# Altium schematic sheet Source.SchDoc
size A4; DocumentNumber: 2; SheetNumber: 2; SheetTotal: 5
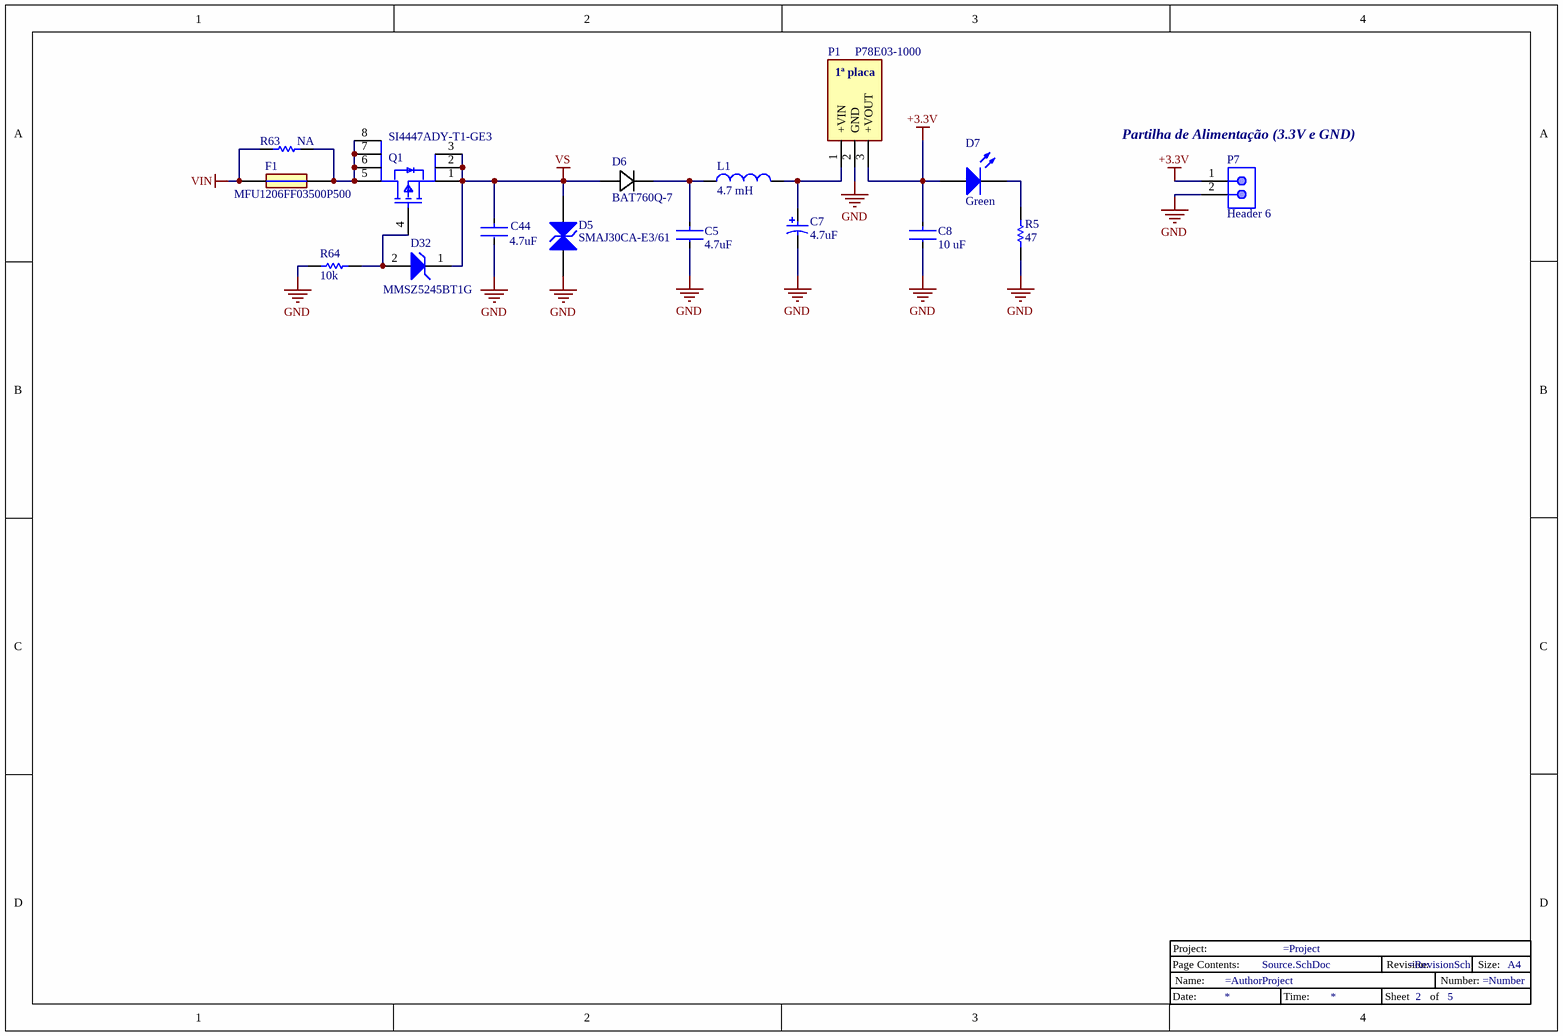
[diagram p0: Source.SchDoc]

## Parts
C5  4.7uF  [FP-GRT21B-0_15-IPC_B]
C7  4.7uF  [KEMT-T491-D_L]
C8  10 uF  [FP-GRM21B-0_2-e0_2_0_7-IPC_C]
C44  4.7uF  [FP-GRT21B-0_15-IPC_B]
D5  SMAJ30CA-E3/61  [VISH-DO-214AC-2_L]
D6  BAT760Q-7  [DIODE_SOD-323_1P7X1P3_DIO-L]
D7  Green  [0805_A]
D32  MMSZ5245BT1G  [ONSC-SOD-123-2-425-04_V]
F1  MFU1206FF03500P500  [RESC3216X65N]
L1  4.7 mH  [WE-TI-LM]
P1  P78E03-1000  [P78E031000]
P7  Header 6  [MOLX-22-27-2021_V]
Q1  SI4447ADY-T1-GE3  [FP-C-06527-MFG]
R5  47  [RESC1608X55X30NL20T20]
R63  NA  [RESC1608X55X25ML10T15]
R64  10k  [RESC1608X55X25ML10T15]
Title_Block_2  Title_Block  (value not drawn)

## Nets
+3.3V: C8.1 D7.2(A) P1.3(+VOUT) P7.1
GND: C5.2 C7.2 C8.2 C44.2 D5.2(A2) P1.2(GND) P7.2 R5.1 R64.1
VIN: F1.1 R63.1
VS: C44.1 D5.1(A1) D6.2 D32.1(K) Q1.1(S) Q1.2(S) Q1.3(S)
NetC5_1: C5.1 D6.1 L1.1
NetC7_1: C7.1 L1.2 P1.1(+VIN)
NetD7_1: D7.1(K) R5.2
NetD32_2: D32.2(A) Q1.4(G) R64.2
NetF1_2: F1.2 Q1.5(D) Q1.6(D) Q1.7(D) Q1.8(D) R63.2

## Notes on the sheet
- 1ª placa
- (near P7) Partilha de Alimentação (3.3V e GND)
- (in symbol Title_Block) Project:; Page Contents:; Revision:; Size:; A4; Name:; Number:; Date:; Time:; Sheet; of

## Library data of the parts
C5 C44 = CMP-06035-019733-1: Cap Ceramic 4.7uF 50V X5R ±10% SMD 0805 +85°C Emboss T/R; Voltage Rating: 50V; Mount: Surface Mount; Ratings: AEC-Q200; Packaging: Tape and Reel; Width: 0.049inch; Case/Package: 0805; Max Operating Temperature: 85°C; Length: 0.079inch; Case Code (Imperial): 0805; Capacitance: 4.7uF; Thickness: 0.057inch; Min Operating Temperature: -55°C; Case Code (Metric): 2012; Dielectric: X5R; Tolerance: 10%; Voltage Rating (DC): 50V
C7 = CMP-2000-07203-1: Tantalum Surface Mount Capacitor, 4.7 uF, +/- 20%, 50 V, -55 to 125 degC, 2-Pin SMD, RoHS, Tape and Reel T491D475M050AT; Manufacturer: Kemet; DF: 6%; Polarity: Polar; Voltage: 50VDC; Product Depth (mm): 4.3mm; Insulation: NotRequired; DCL: 2.4uA; Product Height (mm): 2.8mm; Rad Hardened: No; Capacitance: 4700000pF; Product Length (mm): 7.3mm; ESR: 1.4ohm; Case Style: Molded; Lead Spacing (nom): NotRequiredmm; Packaging: TapeandReel; Operating Temp Range: -55Cto125C; Mounting Style: SurfaceMount; Length W/Weld (max): NotRequiredmm; Package Reference: T491-D; Construction: SMTChip; Case Code: D; Package Description: 2-Pin Surface Mount Device, Body 7.3 x 4.3 mm; Seated Plane Height: NotRequiredmm; Wire Form: NotRequired; Mounting Technology: SurfaceMount; Manufacturer URL: http://www.kemet.com/; Seal: NotRequired; Tolerance (+ or -): 20%; Failure Rate: NotRequired; Datasheet Version: 06/2016; Length W/Weld: NotRequiredmm; Package / Case: 7343-31; Product Diameter (mm): NotRequiredmm; Datasheet URL: http://www.kemet.com/Lists/ProductCatalog/Attachments/254/KEM_T2005_T491.pdf
C8 = CMP-06035-005015-1: Chip Multilayer Ceramic Capacitors for General Purpose, 0805, 10uF, X5R, 15%, 10%, 50V GRM21BR61H106KE43K
D5 = CMP-0548-00185-2: Transient Voltage Suppressor, 6.40 to 231 V, 30 V Stand-off Voltage, Bi-Directional, -55 to 155 degC, 2-pin DO-214AC, Pb-Free, Tape and Reel; Manufacturer: Vishay Semiconductor; ID (uA): 2; IFSM: 40 A; PPPM (W): 400, 300; VWM (V): 30; VBR Bi-Directional (V): 6.4 to 231; PartNumber: SMAJ30CA-E3/61; Mounting Technology: Surface Mount; Operating Junction and Storage Temperature Range: -55 to 150 degC; ComponentLink1Description: Manufacturer URL; PackageReference: DO-214AC-2; ComponentLink3URL: http://www.vishay.com/docs/88390/smaj50a.pdf; ComponentLink2URL: http://www.vishay.com/docs/88390/smaj50a.pdf; RoHS: TRUE; DatasheetVersion: 12/8/2013; Packing: Tape and Reel; ComponentLink1URL: http://www.vishay.com/; ComponentLink2Description: Datasheet; ComponentLink3Description: Package Specification; PackageDescription: 2-Pin DO-214AC (SMA), Body 4.245 x 2.665 mm
D6 = BAT760Q-7: No Description Available; Vendor: Diodes Inc; Built_By: EMA_Anthony; SourceLibrary: Diodes_Inc_2020-03-05; Type: DEV; Datasheet: https://media.digikey.com/pdf/Data%20Sheets/Diodes%20PDFs/BAT760.pdf; Copyright: Copyright (C) 2018 Accelerated Designs. All rights reserved; Manufacturer_Part_Number: BAT760Q-7; RefDes: RefDes
D7 = CMP-1426-00009-1: SMD mono-color Chip LED, WL-SMCW, Bright Green; PartNumber: 150080VS75000; Manufacturer: Wuerth Elektronik; ComponentLink1Description: Manufacturer URL; Color: Bright Green; PackageReference: 0805_A; ComponentLink1URL: http://www.we-online.com; ComponentLink2Description: Datasheet; ComponentLink2URL: http://katalog.we-online.com/led/datasheet/150080VS75000.pdf
D32 = CMP-1060-00535-1: Zener Voltage Regulator, 500 mW, 2-Pin SOD-123, Pb-Free, Tape and Reel; Manufacturer: On Semiconductor; P Max (W): 0.5; VZ Typ (V): 15; ComponentLink3URL: http://www.onsemi.com/pub_link/Collateral/425-04.PDF; Packing: Tape and Reel; DatasheetVersion: Rev. 12; ComponentLink2URL: http://www.onsemi.com/pub_link/Collateral/MMSZ5221BT1-D.PDF; Mounting Technology: Surface Mount; ComponentLink1Description: Manufacturer URL; ComponentLink1URL: http://www.onsemi.com/; ComponentLink2Description: Datasheet; PackageVersion: Rev. G, 10/2009; PackageReference: SOD-123-2-425-04; PackageDescription: 2-Pin SOD, Body 1.6 x 2.69 mm; ComponentLink3Description: Package Specification; RoHS: Pb-Free; PartNumber: MMSZ5245BT1G
F1 = MFU1206FF00500P100: Fuse; Manufacturer_Name: Vishay; Datasheet Link: http://www.vishay.com/docs/28747/mfuserie.pdf; Height: 0.65mm; Manufacturer_Part_Number: MFU1206FF00500P100; Mouser Part Number: 594-MFU1206FF00500P1; Mouser Price/Stock: https://www.mouser.co.uk/ProductDetail/Vishay-Beyschlag/MFU1206FF00500P100?qs=oI046glRurs9%2FzbQ%2Fl2sBw%3D%3D; Arrow Part Number: MFU1206FF00500P100; Arrow Price/Stock: https://www.arrow.com/en/products/mfu1206ff00500p100/vishay
L1 = CMP-0225-00066-1: Radial Leaded Wire Wound Inductor WE-TI, L = 4700 µH 7447721047; Inductance: 4700 ÂµH; DatasheetVersion: ver 3, Feb-2008; ComponentLink2Description: Datasheet; PackageVersion: 2008; ComponentLink1Description: Manufacturer Link; PackageDescription: THT Inductor, 2-Leads, Body 7.8 x 7.8 mm; PackageReference: WE-TI-LM; ComponentLink1URL: http://www.we-online.com; ComponentLink2URL: http://www.we-online.de/katalog/media/pdf/7447721047.pdf
P1 = P78E03-1000: Connector; Manufacturer_Name: CUI Inc.; Datasheet Link: https://www.mouser.com/datasheet/2/670/p78e-1000-1480573.pdf; Height: 10.9mm; Manufacturer_Part_Number: P78E03-1000; Mouser Part Number: 490-P78E03-1000; Mouser Price/Stock: https://www.mouser.co.uk/ProductDetail/CUI-Inc/P78E03-1000?qs=qSfuJ%252Bfl%2Fd7nA5RBt1peaw%3D%3D; Arrow Part Number: P78E03-1000; Arrow Price/Stock: https://www.arrow.com/en/products/p78e03-1000/cui-inc
P7 = CMP-2000-05537-1: Male Header, Pitch 2.54 mm, 1 x 2 Position, Height 11.7 mm, Tail Length 3.56 mm, 0 to 75 degC, RoHS, Bulk; Manufacturer: Molex; PartNumber: 0022272021; Current rating: 4A; Package Version: Rev. BC, 02/2012; Voltage rating: 250V; No. of Positions: 2; Pitch: 2.54mm; No. of Rows: 1; Orientation: Vertical; Operating temperature: 0°Cto+75°C; Manufacturer URL: http://www.molex.com/; Mounting Technology: ThroughHole; Housing material: Nylon(UL94V-0); Package Description: 2-Leads Header, Body 5.08 x 5.8 mm, Pitch 2.54 mm; Voltage - Max: 250V; Datasheet URL: http://www.molex.com/pdm_docs/sd/022272021_sd.pdf; Package Reference: 22-27-2021; Contact material: Tinplatedbrass; Current - Max: 4A; Datasheet Version: Rev. F, 06/2009
Q1 = CMP-02550-000125-1: MOSFET P-CH 40V 7.2A 8SOIC; Manufacturer: Vishay; Standoff Height: 0.1mm; Max Forward Diode Voltage: -1.2V; Turn Off Delay Time: 30ns; Number Of P Channels: 1; Depletion Mode: False; Typ Forward Diode Voltage: -0.76V; Pulse Drain Current: -20A; Gate Charge At Vgs: 25nC @ -10V; Rthja Max: 40°C/W; Transconductance: 14S; Reverse Recovery Time: 27ns; Continuous Drain Current: -5.5A; Drain To Source Voltage: -40V; Max Junction Temp: +150°C; Input Capacitace At Vds: 970pF @ -20V; Turn On Delay Time: 7ns; Threshold Vgs Max: -2.5V; Drain To Source Resistance: 0.036Ω; Gate To Source Voltage: 20V; Reverse Recovery Charge: 19nC; Power Dissipation: 2.5W; Temperature: -55°C to +150°C; Device Class L3: MOSFETs; Manufacturer Part Number: SI4447ADY-T1-GE3; Temperature Range Low: -55°C; Octopart: https://octopart.com/si4447ady-t1-ge3-vishay-44677033; ComponentLink2Description: Datasheet; Threshold Vgs Min: -1.2V; Automotive: No; ComponentLink2URL: http://www.vishay.com/docs/67189/si4447ad.pdf; Category: Trans; Package: C-06527; Device Class L1: Discrete Semiconductors; Number Of Channels: 1; Digikey Description: MOSFET P-CH 40V 7.2A 8SOIC; Mouser Description: Si4447ADY Series 40 V 45 mOhm 7.2 A Surface Mount P-Channel Mosfet - SOIC-8; Temperature Range High: +150°C; Height: 1.75mm; Drain To Source Breakdown Voltage: -40V; Lead Free: Yes; Device Class L2: Transistors; RoHS: TRUE
R5 = CMP-2000-00070-1: Part Number: ERA3AEB470V; Manufacturer: Panasonic
R63 = CMP-2100-03667-1: Chip Resistor, 0 Ohm, +/- 5%, 0.1 W, -55 to 155 degC, 0603 (1608 Metric), RoHS, Tape and Reel; Manufacturer: Yageo; Temperature Coefficient: 200ppm/degreesC; Voltage Rating: 50V; Power Rating: 100mW; Resistance: 0mOhm; Width: 0.8mm; Max Operating Temperature: 155degC; Tolerance: 5%; Package Reference: 0603; Height: 0.45mm; Depth: 0.8mm; Package Description: 2-Pin Surface Mount Device, Body 1.6 x 0.8 mm; Termination: SMD/SMT; Package Quantity: 5000; Case/Package: 0603; Case Code (Imperial): 0603; Radiation Hardening: No; Number of Pins: 2; Length: 1.6mm; Lead Free: LeadFree; Voltage Rating (DC): 50V; Military Standard: Not; Datasheet URL: http://www.yageo.com/NewPortal/yageodocoutput?fileName=/pdf/R-Chip/PYu-RC_Group_51_RoHS_L_5.pdf; Manufacturer URL: http://www.yageo.com/; Packaging: TapeandReel; Case Code (Metric): 1608; Min Operating Temperature: -55degC; Composition: ThickFilm; RoHSCompliant: true; Contact Plating: Tin; Datasheet Version: Rev. 5, 10/2016; REACH SVHC: NoSVHC
R64 = CMP-2000-05022-1: Resistor, 10 kOhm, +/- 5%, 100 mW, -55 to 155 degC, 0603 (1608 Metric), RoHS, Tape and Reel; Manufacturer: Yageo; Resistance: 10kOhms; Voltage Rating: 50V; Temperature Coefficient: 100PPM/C; Power Rating: 100mW; Package Reference: 603; Series: RC; Case Code - mm: 1608; Packaging: Reel; Datasheet URL: http://www.farnell.com/datasheets/443971.pdf; Datasheet Version: Rev. 4, 04/2009; Operating Temperature Range: -55Cto+155C; Product: ThickFilmResistorsGeneralPurpose; Package Description: 2-Pin Surface Mount Device, Body 1.6 x 0.8 mm; Manufacturer URL: http://www.yageo.com/; Case Code - in: 0603; Tolerance: 5%; Termination Style: SMD/SMT